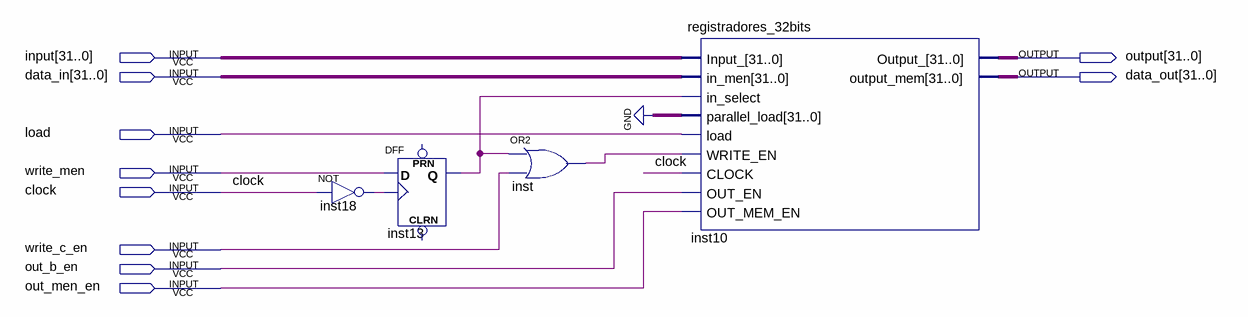
[diagram p0: schematic sheet]
// Quartus schematic MDR.bdf as structural Verilog: 4 symbols, 10 pins
module MDR (
  input  [31:0] \input ,
  input  [31:0] data_in,
  input  load,
  input  write_men,
  input  clock,
  input  write_c_en,
  input  out_b_en,
  input  out_men_en,
  output [31:0] \output ,
  output [31:0] data_out
);

  wire inst13_q, inst18_out, inst_out;

  not inst18 (inst18_out, clock);
  DFF inst13 (.CLK(inst18_out), .D(write_men), .Q(inst13_q));  // open: CLRN, PRN
  or inst (inst_out, inst13_q, write_c_en);
  registradores_32bits inst10 (
    .Input_(\input ), .in_men(data_in), .in_select(inst13_q), .parallel_load({32{1'b0}}), .load(load),
    .WRITE_EN(inst_out), .CLOCK(clock), .OUT_EN(out_b_en), .OUT_MEM_EN(out_men_en), .Output_(\output ),
    .output_mem(data_out));
endmodule
